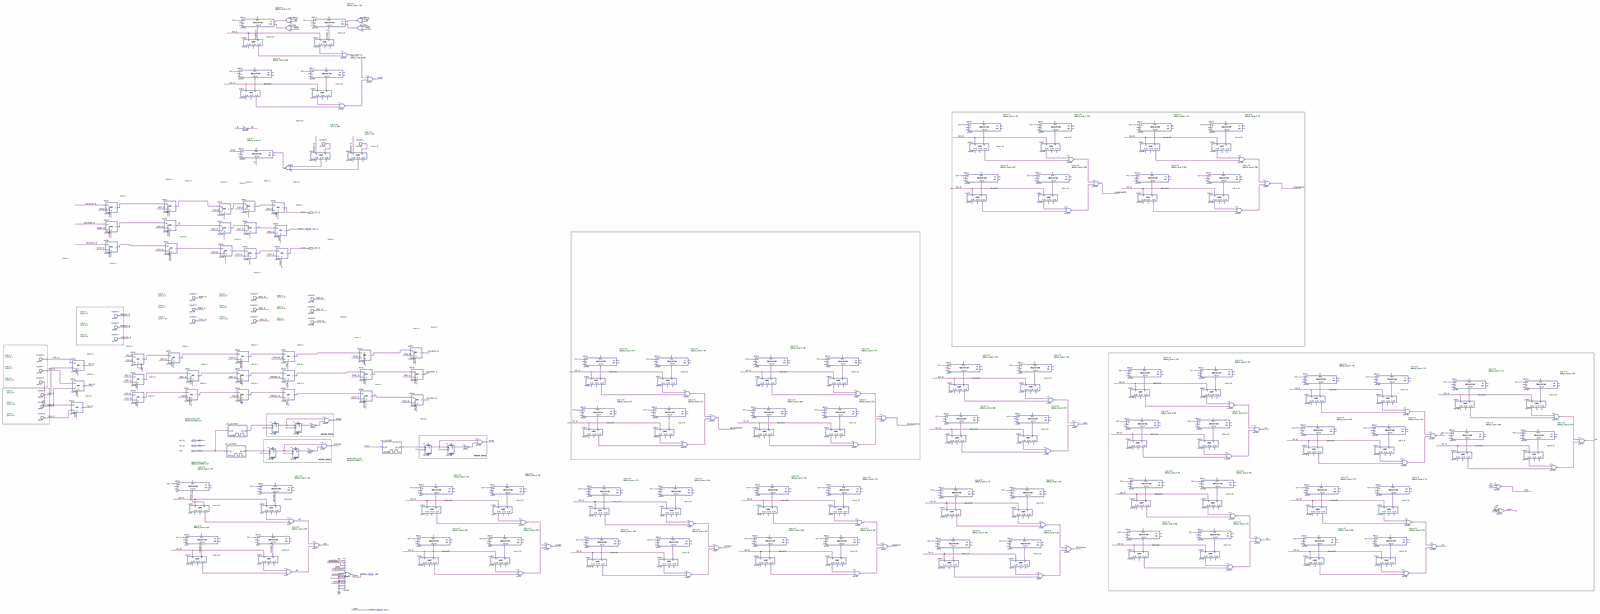
[diagram p0: schematic sheet, whole]
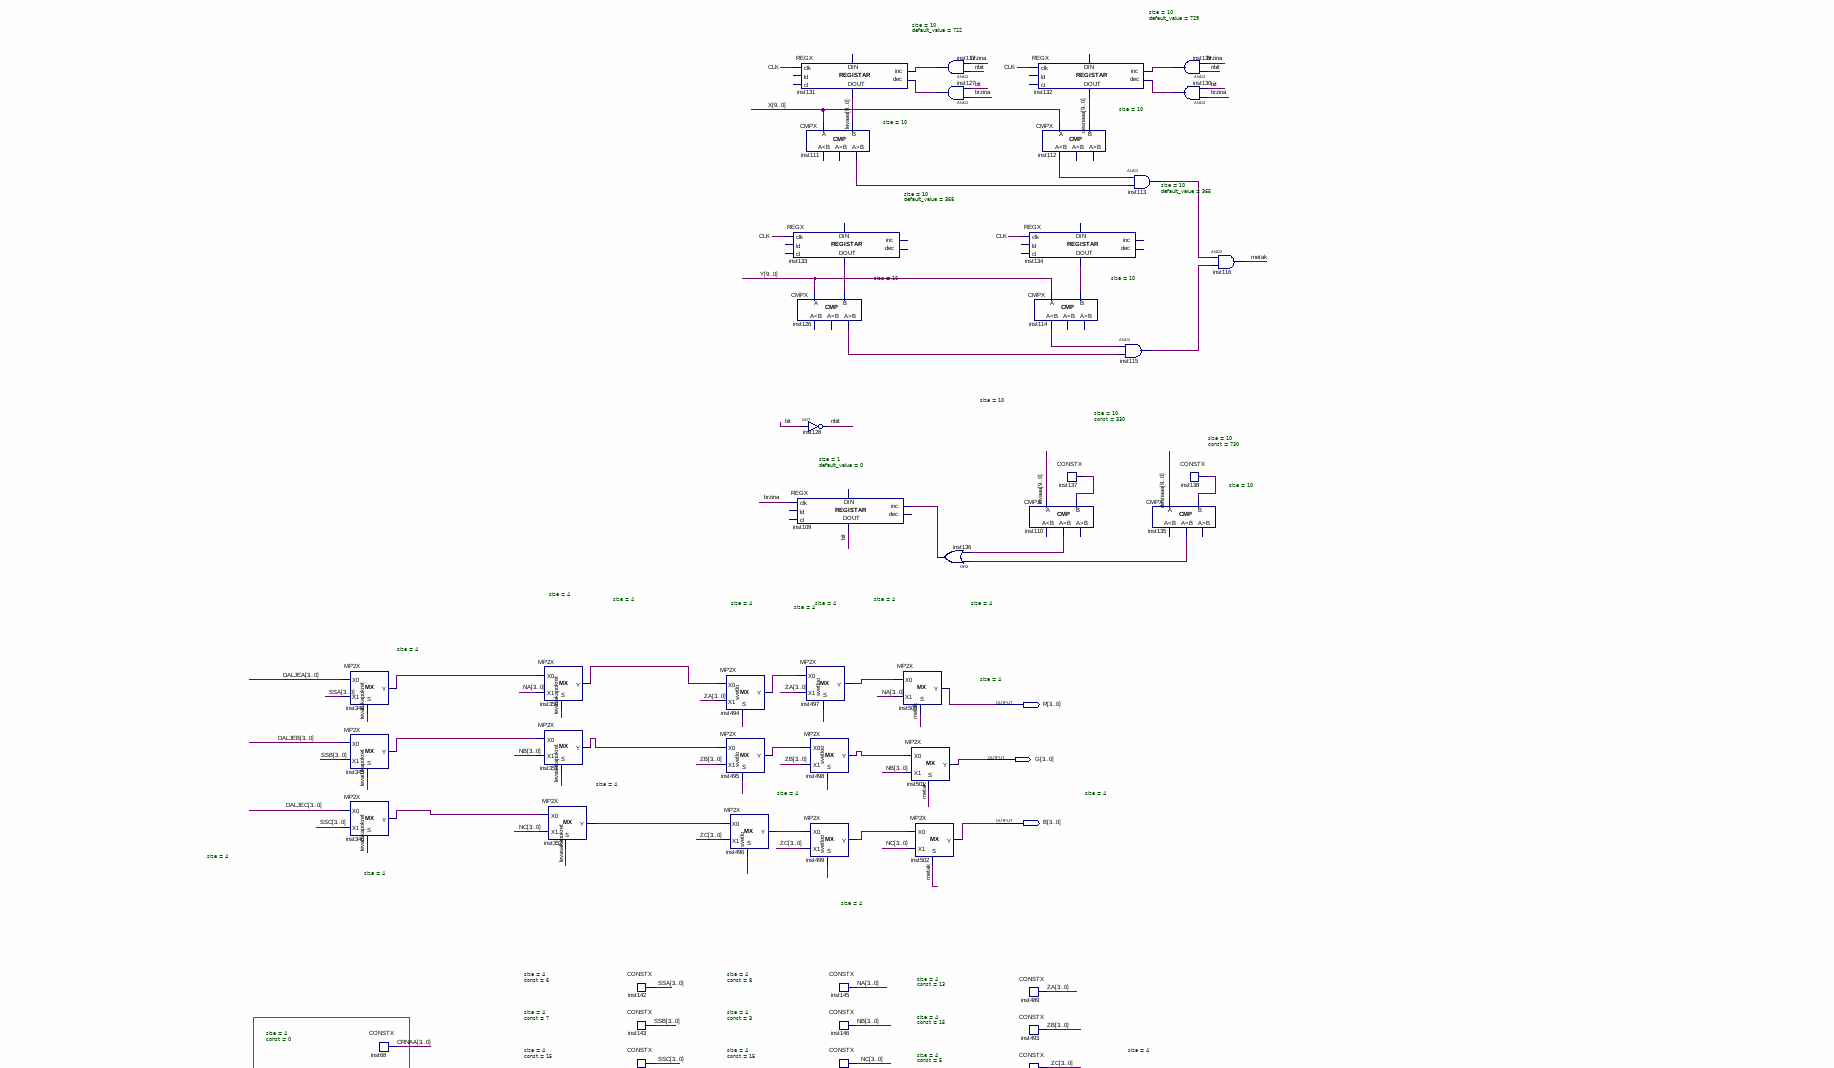
[diagram p1: schematic sheet, upper left part]
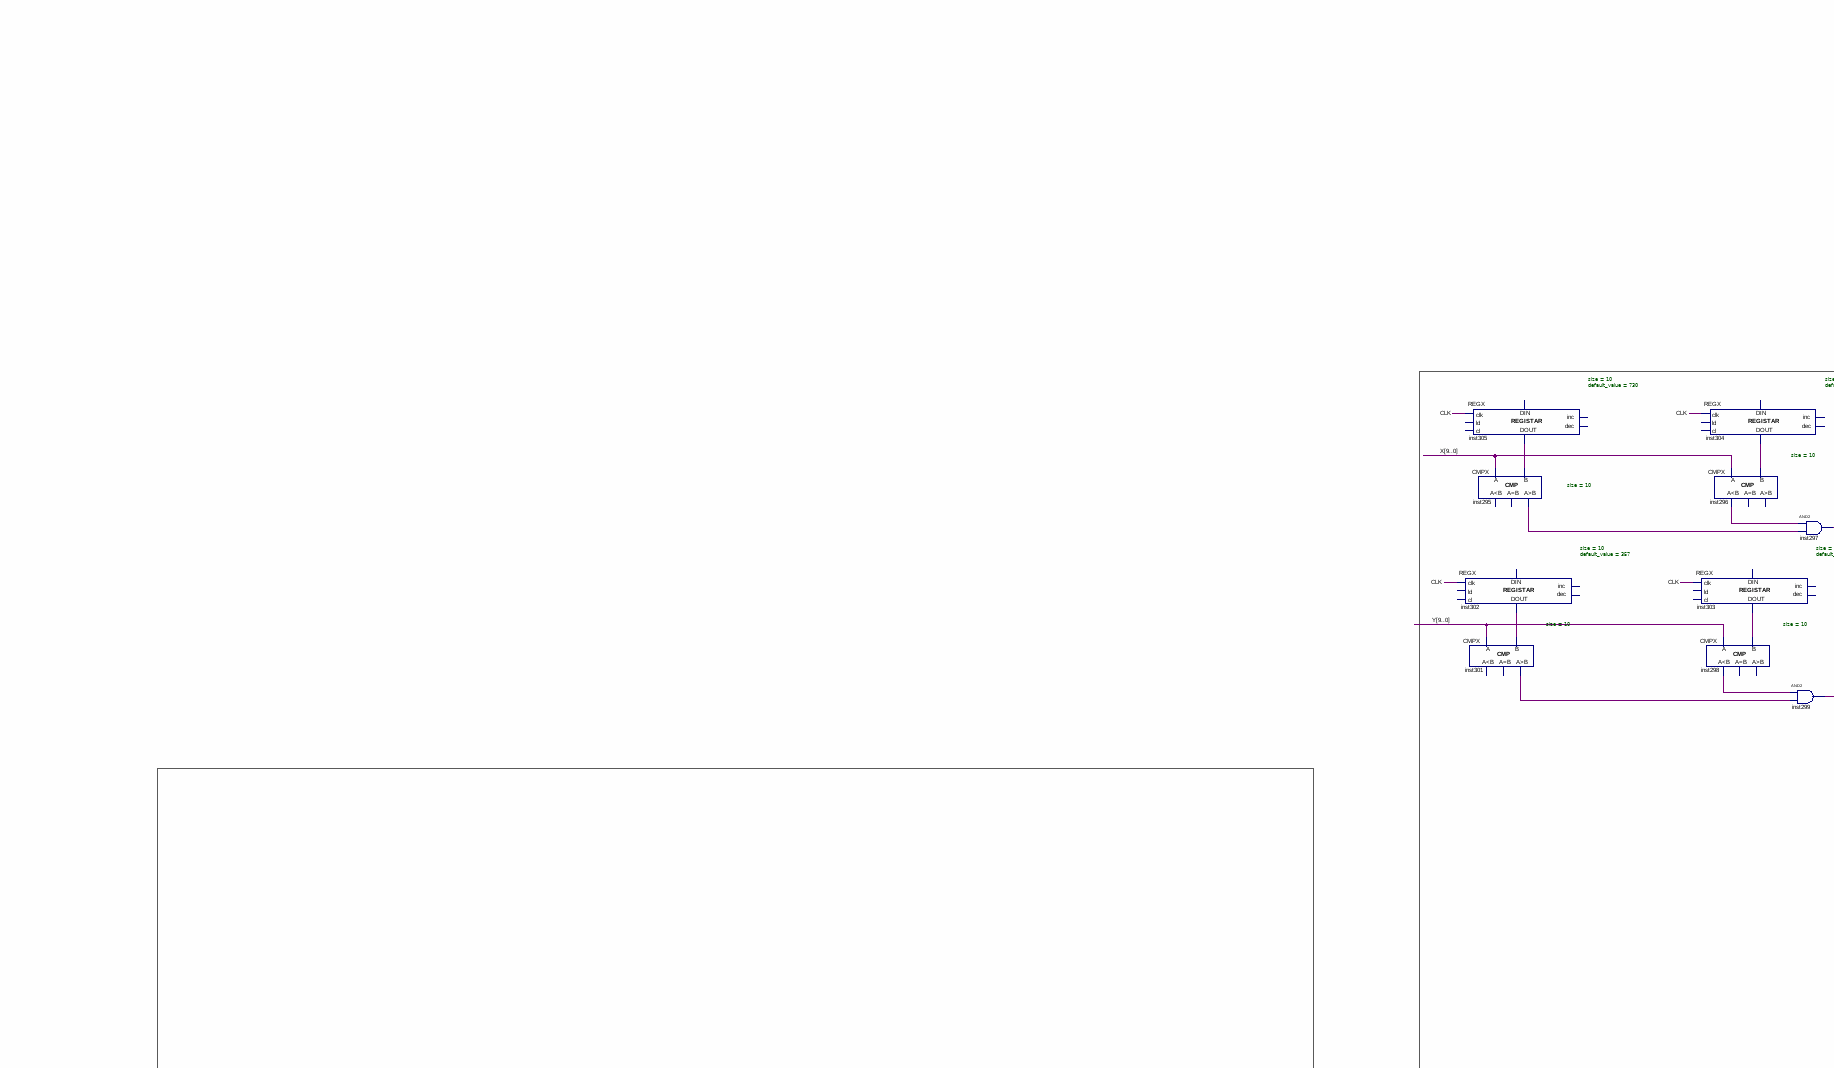
[diagram p2: schematic sheet, upper centre part]
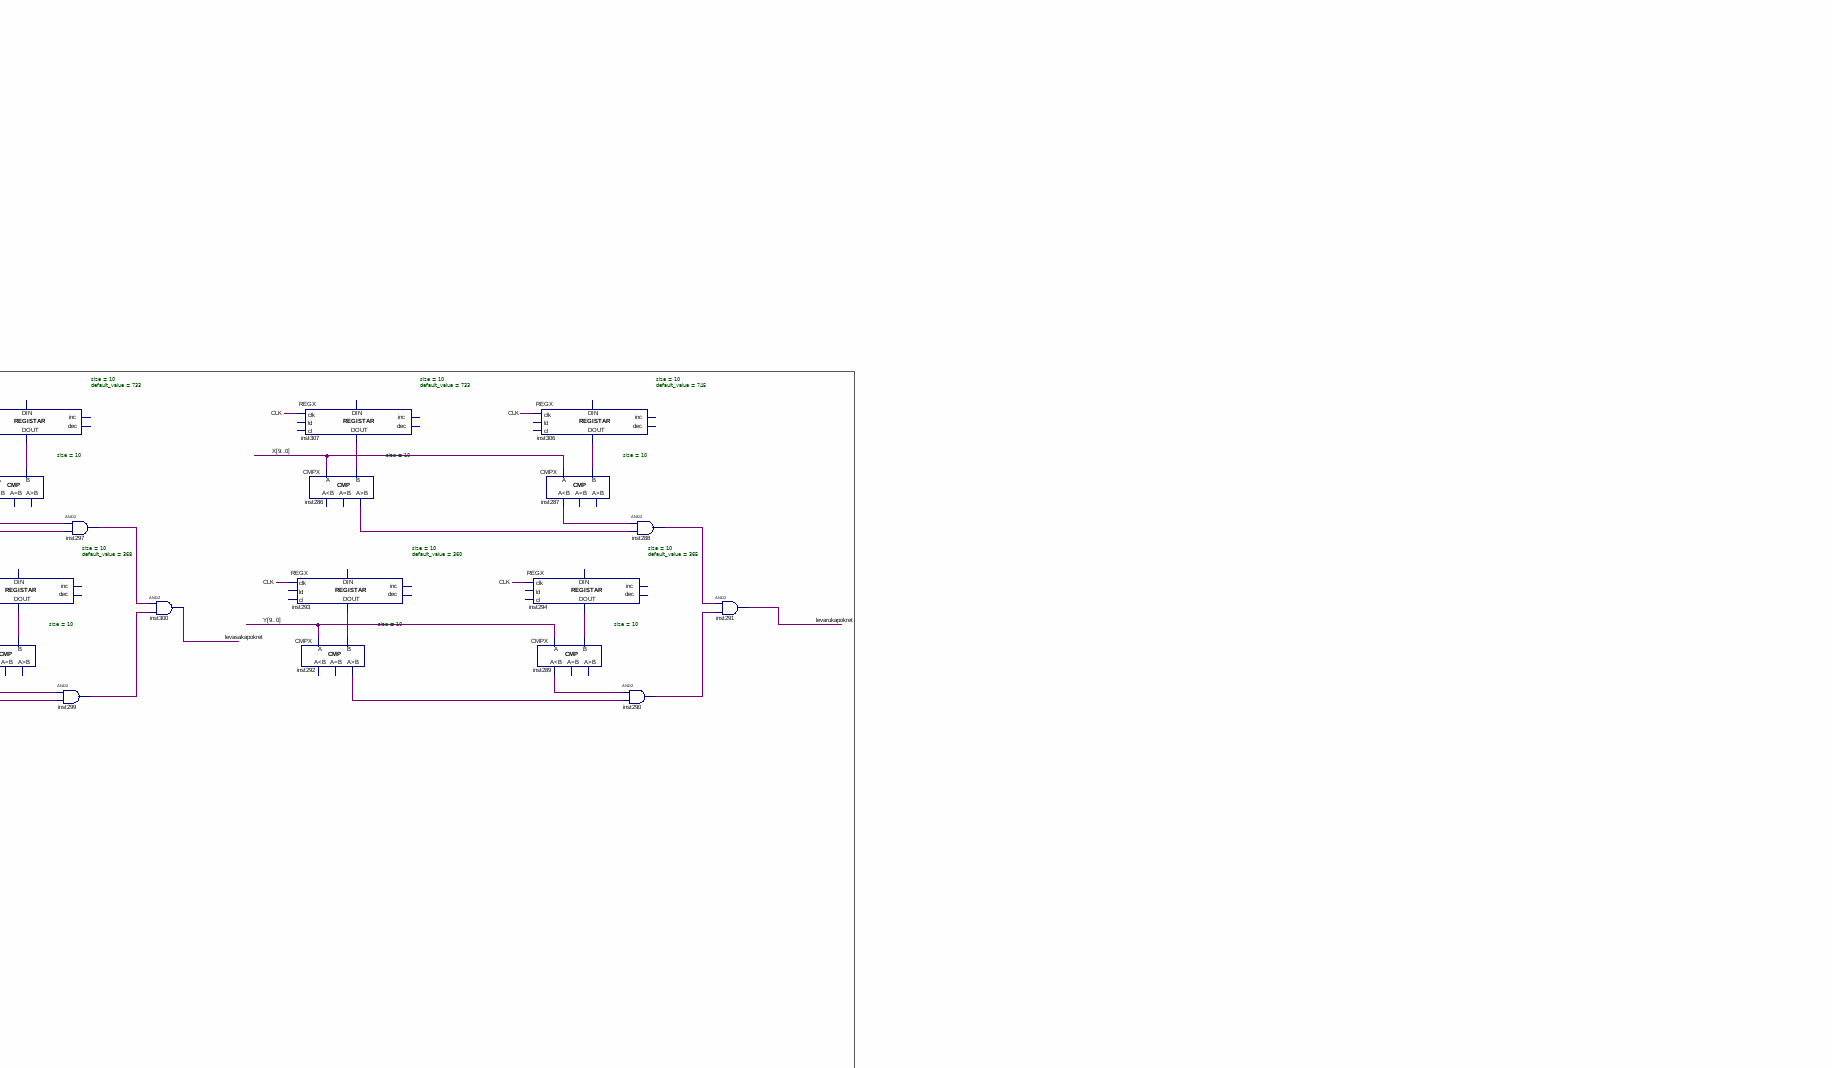
[diagram p3: schematic sheet, upper right part]
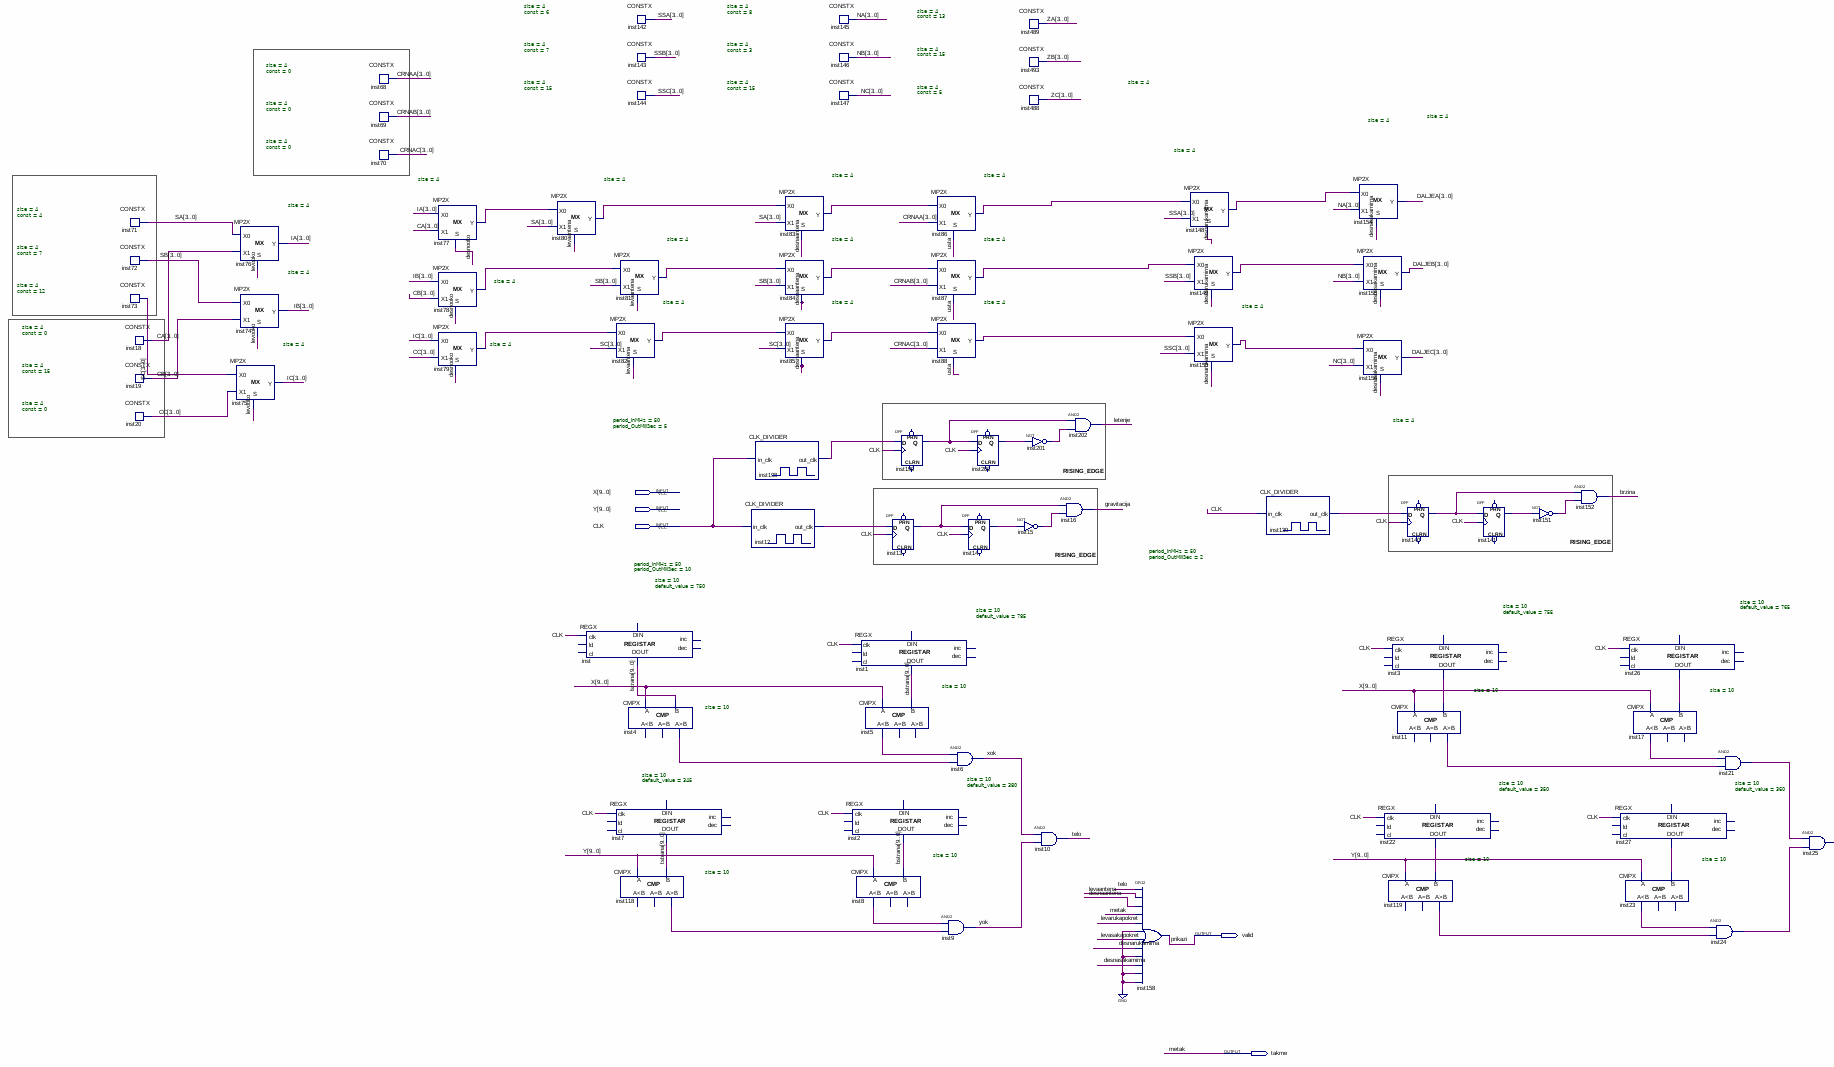
[diagram p4: schematic sheet, lower left part]
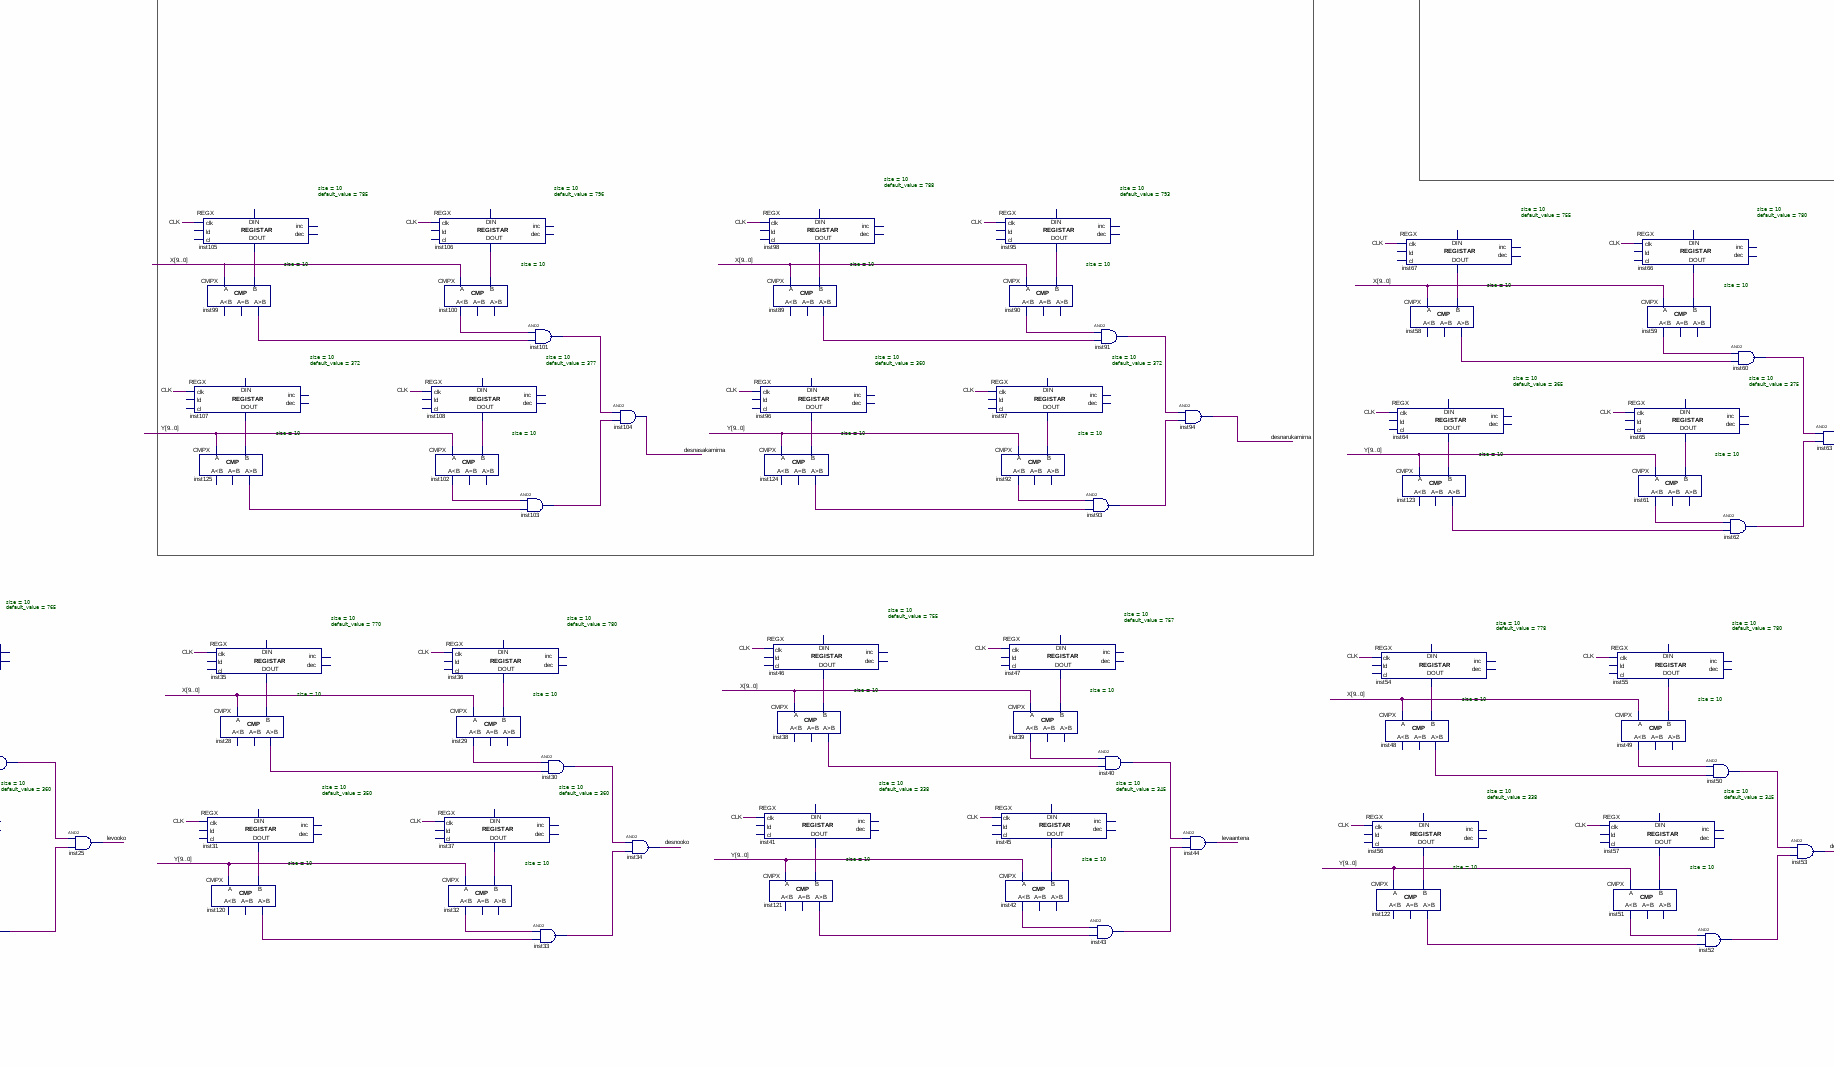
[diagram p5: schematic sheet, lower centre part]
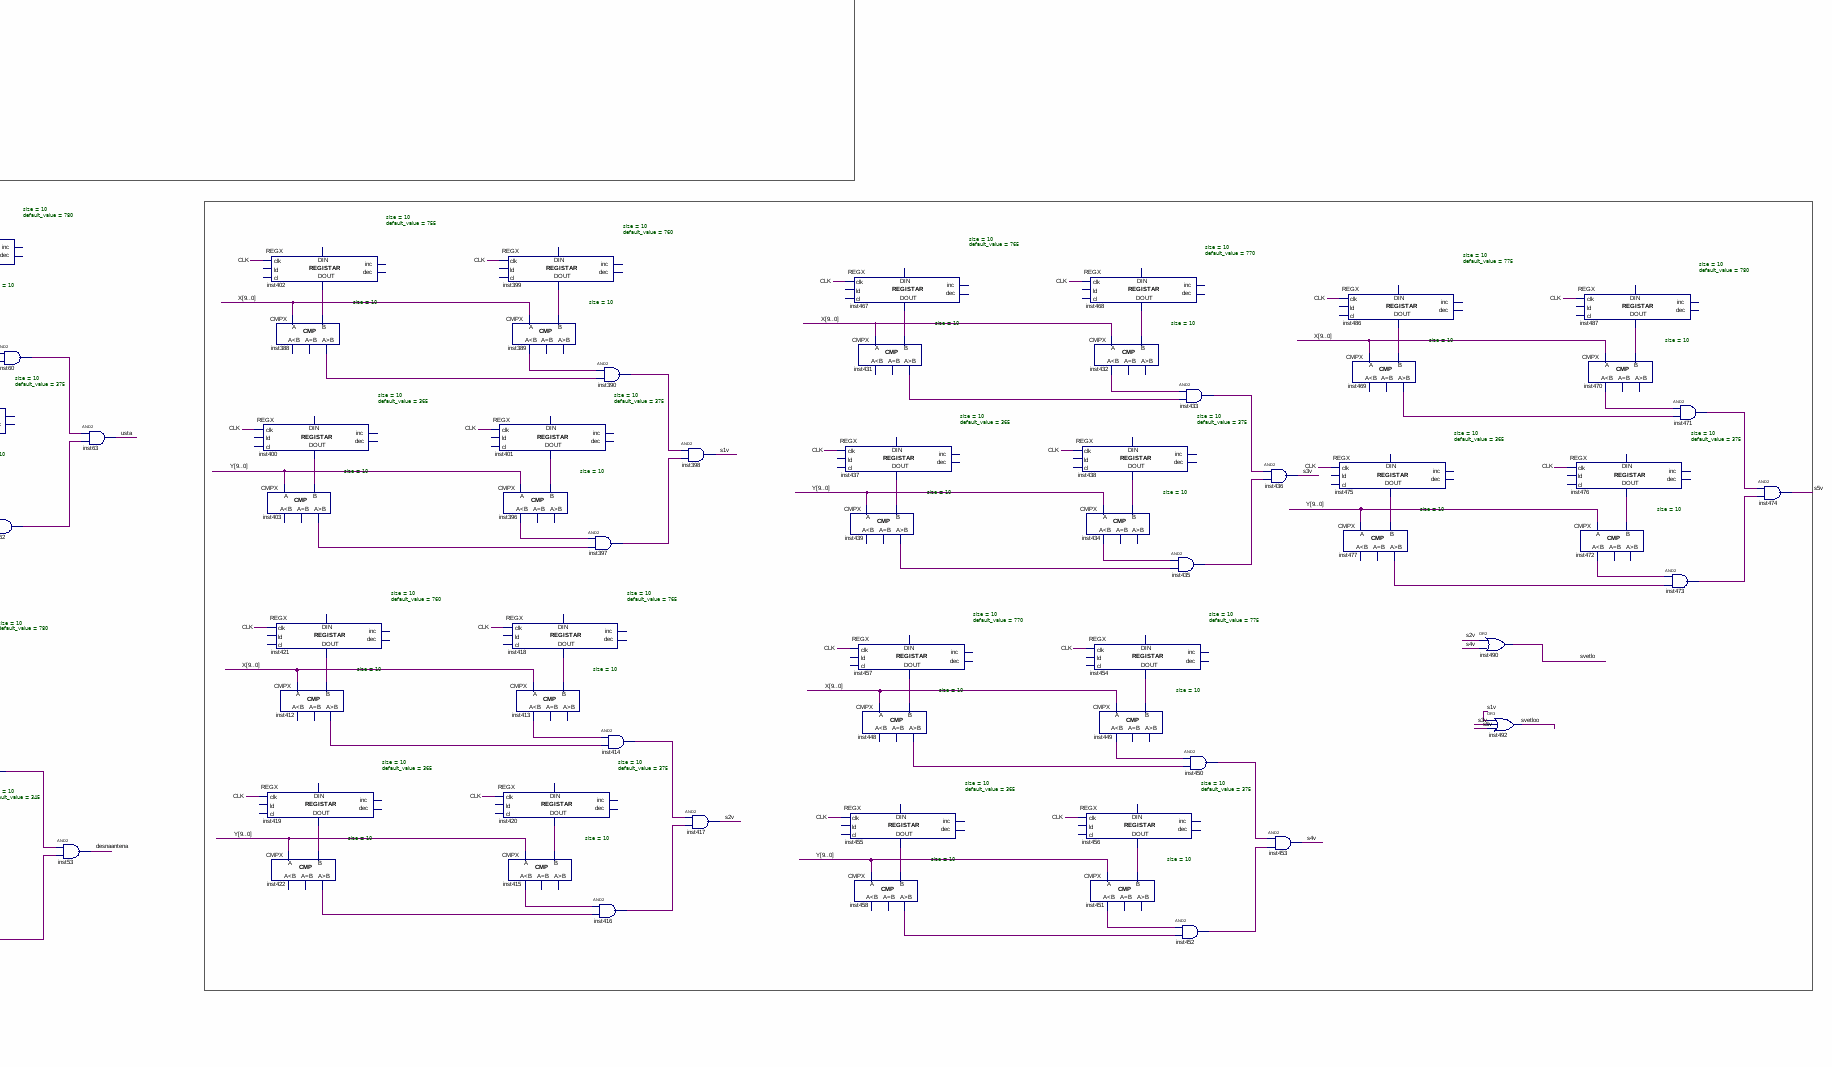
[diagram p6: schematic sheet, lower right part]
// Quartus schematic Bot3.bdf as structural Verilog: 259 symbols, 8 pins
module Bot3 (
  input  [9:0] X,
  input  [9:0] Y,
  input  CLK,
  output [3:0] R,
  output [3:0] G,
  output [3:0] B,
  output valid,
  output takme
);

  wire \bit , brzina, desnaantena, desnarukamirna, desnasakamirna, desnooko, gravitacija, inst4_gr, inst5_ls,
       inst8_ls, inst11_gr, inst12_out_clk, inst13_q, inst14_q, inst15_out, inst17_ls, inst21_out, inst23_ls,
       inst24_out, inst28_gr, inst29_ls, inst30_out, inst32_ls, inst33_out, inst38_gr, inst39_ls, inst40_out,
       inst42_ls, inst43_out, inst48_gr, inst49_ls, inst50_out, inst51_ls, inst52_out, inst58_gr, inst59_ls,
       inst60_out, inst61_ls, inst62_out, inst89_gr, inst90_ls, inst91_out, inst92_ls, inst93_out, inst99_gr,
       inst100_ls, inst101_out, inst102_ls, inst103_out, inst110_eq, inst111_gr, inst112_ls, inst113_out,
       inst114_ls, inst115_out, inst117_out, inst118_gr, inst119_gr, inst120_gr, inst121_gr, inst122_gr,
       inst123_gr, inst124_gr, inst125_gr, inst126_gr, inst127_out, inst129_out, inst130_out, inst135_eq,
       inst136_out, inst139_out_clk, inst140_q, inst141_q, inst151_out, inst198_out_clk, inst199_q,
       inst200_q, inst201_out, inst286_gr, inst287_ls, inst288_out, inst289_ls, inst290_out, inst292_gr,
       inst295_gr, inst296_ls, inst297_out, inst298_ls, inst299_out, inst301_gr, inst388_gr, inst389_ls,
       inst390_out, inst396_ls, inst397_out, inst403_gr, inst412_gr, inst413_ls, inst414_out, inst415_ls,
       inst416_out, inst422_gr, inst431_gr, inst432_ls, inst433_out, inst434_ls, inst435_out, inst439_gr,
       inst448_gr, inst449_ls, inst450_out, inst451_ls, inst452_out, inst458_gr, inst469_gr, inst470_ls,
       inst471_out, inst472_ls, inst473_out, inst477_gr, letenje, levaantena, levarukapokret, levasakapokret,
       levooko, nbit, s1v, s2v, s3v, s4v, s5v, svetlo, svetloo, telo, usta, xok, yok;
  wire [3:0] CA, CB, CC, CRNAA, CRNAB, CRNAC, DALJEA, DALJEB, DALJEC, IA, IB, IC, inst77_y, inst78_y,
       inst79_y, inst80_y, inst81_y, inst82_y, inst83_y, inst84_y, inst85_y, inst86_y, inst87_y, inst88_y,
       inst148_y, inst149_y, inst150_y, inst344_y, inst345_y, inst346_y, inst350_y, inst351_y, inst352_y,
       inst494_y, inst495_y, inst496_y, inst497_y, inst498_y, inst499_y, NA, NB, NC, SA, SB, SC, SSA, SSB,
       SSC, ZA, ZB, ZC;
  wire [9:0] bstrana, desnaaa, dstrana, inst3_data_out, inst22_data_out, inst26_data_out, inst27_data_out,
       inst31_data_out, inst35_data_out, inst36_data_out, inst37_data_out, inst41_data_out, inst45_data_out,
       inst46_data_out, inst47_data_out, inst54_data_out, inst55_data_out, inst56_data_out, inst57_data_out,
       inst64_data_out, inst65_data_out, inst66_data_out, inst67_data_out, inst95_data_out, inst96_data_out,
       inst97_data_out, inst98_data_out, inst105_data_out, inst106_data_out, inst107_data_out,
       inst108_data_out, inst133_data_out, inst134_data_out, inst137_data, inst138_data, inst293_data_out,
       inst294_data_out, inst302_data_out, inst303_data_out, inst304_data_out, inst305_data_out,
       inst306_data_out, inst307_data_out, inst399_data_out, inst400_data_out, inst401_data_out,
       inst402_data_out, inst418_data_out, inst419_data_out, inst420_data_out, inst421_data_out,
       inst437_data_out, inst438_data_out, inst454_data_out, inst455_data_out, inst456_data_out,
       inst457_data_out, inst467_data_out, inst468_data_out, inst475_data_out, inst476_data_out,
       inst486_data_out, inst487_data_out, levaaa, lstrana, tstrana;

  CONSTX #(.size(4), .\const (4)) inst71 (.data(SA));
  CONSTX #(.size(4), .\const (7)) inst72 (.data(SB));
  CONSTX #(.size(4), .\const (12)) inst73 (.data(SC));
  CONSTX #(.size(4), .\const (0)) inst18 (.data(CA));
  CONSTX #(.size(4), .\const (15)) inst19 (.data(CB));
  CONSTX #(.size(4), .\const (0)) inst20 (.data(CC));
  MP2X #(.size(4)) inst76 (.S(levooko), .X0(SA), .X1(CA), .Y(IA));
  MP2X #(.size(4)) inst74 (.S(levooko), .X0(SB), .X1(CB), .Y(IB));
  MP2X #(.size(4)) inst75 (.S(levooko), .X0(SC), .X1(CC), .Y(IC));
  MP2X #(.size(4)) inst344 (.S(levarukapokret), .X0(DALJEA), .X1(SSA), .Y(inst344_y));
  MP2X #(.size(4)) inst345 (.S(levarukapokret), .X0(DALJEB), .X1(SSB), .Y(inst345_y));
  MP2X #(.size(4)) inst346 (.S(levarukapokret), .X0(DALJEC), .X1(SSC), .Y(inst346_y));
  CONSTX #(.size(4), .\const (0)) inst68 (.data(CRNAA));
  CONSTX #(.size(4), .\const (0)) inst69 (.data(CRNAB));
  CONSTX #(.size(4), .\const (0)) inst70 (.data(CRNAC));
  MP2X #(.size(4)) inst77 (.S(desnooko), .X0(IA), .X1(CA), .Y(inst77_y));
  MP2X #(.size(4)) inst78 (.S(desnooko), .X0(IB), .X1(CB), .Y(inst78_y));
  MP2X #(.size(4)) inst79 (.S(desnooko), .X0(IC), .X1(CC), .Y(inst79_y));
  MP2X #(.size(4)) inst350 (.S(levasakapokret), .X0(inst344_y), .X1(NA), .Y(inst350_y));
  MP2X #(.size(4)) inst351 (.S(levasakapokret), .X0(inst345_y), .X1(NB), .Y(inst351_y));
  MP2X #(.size(4)) inst352 (.S(levasakapokret), .X0(inst346_y), .X1(NC), .Y(inst352_y));
  MP2X #(.size(4)) inst80 (.S(levaantena), .X0(inst77_y), .X1(SA), .Y(inst80_y));
  REGX #(.size(10), .default_value(750)) inst (.clk(CLK), .data_out(lstrana));  // open: ld, cl, inc, dec, data_in
  CONSTX #(.size(4), .\const (6)) inst142 (.data(SSA));
  CONSTX #(.size(4), .\const (7)) inst143 (.data(SSB));
  CONSTX #(.size(4), .\const (15)) inst144 (.data(SSC));
  MP2X #(.size(4)) inst81 (.S(levaantena), .X0(inst78_y), .X1(SB), .Y(inst81_y));
  MP2X #(.size(4)) inst82 (.S(levaantena), .X0(inst79_y), .X1(SC), .Y(inst82_y));
  CMPX #(.size(10)) inst4 (.A(X), .B(lstrana), .gr(inst4_gr));  // open: ls, eq
  REGX #(.size(10), .default_value(345)) inst7 (.clk(CLK), .data_out(tstrana));  // open: ld, cl, inc, dec, data_in
  CMPX #(.size(10)) inst118 (.A(Y), .B(tstrana), .gr(inst118_gr));  // open: ls, eq
  MP2X #(.size(4)) inst494 (.S(svetlo), .X0(inst350_y), .X1(ZA), .Y(inst494_y));
  MP2X #(.size(4)) inst495 (.S(svetlo), .X0(inst351_y), .X1(ZB), .Y(inst495_y));
  MP2X #(.size(4)) inst496 (.S(svetlo), .X0(inst352_y), .X1(ZC), .Y(inst496_y));
  CLK_DIVIDER #(.period_InMHz(50), .period_OutMiliSec(5)) inst198 (.in_clk(CLK), .out_clk(inst198_out_clk));
  CLK_DIVIDER #(.period_InMHz(50), .period_OutMiliSec(10)) inst12 (.in_clk(CLK), .out_clk(inst12_out_clk));
  REGX #(.size(10), .default_value(722)) inst131 (
    .clk(CLK), .inc(inst117_out), .dec(inst127_out), .data_out(levaaa));  // open: ld, cl, data_in
  CMPX #(.size(10)) inst111 (.A(X), .B(levaaa), .gr(inst111_gr));  // open: ls, eq
  REGX #(.size(10), .default_value(358)) inst133 (
    .clk(CLK), .data_out(inst133_data_out));  // open: ld, cl, inc, dec, data_in
  CMPX #(.size(10)) inst126 (.A(Y), .B(inst133_data_out), .gr(inst126_gr));  // open: ls, eq
  not inst128 (nbit, \bit );
  REGX #(.size(1), .default_value(0)) inst109 (
    .clk(brzina), .inc(inst136_out), .data_out(\bit ));  // open: ld, cl, dec, data_in
  MP2X #(.size(4)) inst497 (.S(svetloo), .X0(inst494_y), .X1(ZA), .Y(inst497_y));
  MP2X #(.size(4)) inst498 (.S(svetloo), .X0(inst495_y), .X1(ZB), .Y(inst498_y));
  MP2X #(.size(4)) inst499 (.S(svetloo), .X0(inst496_y), .X1(ZC), .Y(inst499_y));
  MP2X #(.size(4)) inst83 (.S(desnaantena), .X0(inst80_y), .X1(SA), .Y(inst83_y));
  MP2X #(.size(4)) inst84 (.S(desnaantena), .X0(inst81_y), .X1(SB), .Y(inst84_y));
  MP2X #(.size(4)) inst85 (.S(desnaantena), .X0(inst82_y), .X1(SC), .Y(inst85_y));
  CONSTX #(.size(4), .\const (8)) inst145 (.data(NA));
  CONSTX #(.size(4), .\const (3)) inst146 (.data(NB));
  CONSTX #(.size(4), .\const (15)) inst147 (.data(NC));
  REGX #(.size(10), .default_value(785)) inst1 (.clk(CLK), .data_out(dstrana));  // open: ld, cl, inc, dec, data_in
  CMPX #(.size(10)) inst5 (.A(X), .B(dstrana), .ls(inst5_ls));  // open: eq, gr
  REGX #(.size(10), .default_value(380)) inst2 (.clk(CLK), .data_out(bstrana));  // open: ld, cl, inc, dec, data_in
  CMPX #(.size(10)) inst8 (.A(Y), .B(bstrana), .ls(inst8_ls));  // open: eq, gr
  MP2X #(.size(4)) inst500 (.S(takme), .X0(inst497_y), .X1(NA), .Y(R));
  MP2X #(.size(4)) inst501 (.S(takme), .X0(inst498_y), .X1(NB), .Y(G));
  MP2X #(.size(4)) inst502 (.S(takme), .X0(inst499_y), .X1(NC), .Y(B));
  DFF inst199 (.CLK(CLK), .D(inst198_out_clk), .Q(inst199_q));  // open: CLRN, PRN
  DFF inst13 (.CLK(CLK), .D(inst12_out_clk), .Q(inst13_q));  // open: CLRN, PRN
  and inst117 (inst117_out, nbit, brzina);
  and inst127 (inst127_out, brzina, \bit );
  or inst136 (inst136_out, inst135_eq, inst110_eq);
  MP2X #(.size(4)) inst86 (.S(usta), .X0(inst83_y), .X1(CRNAA), .Y(inst86_y));
  MP2X #(.size(4)) inst87 (.S(usta), .X0(inst84_y), .X1(CRNAB), .Y(inst87_y));
  MP2X #(.size(4)) inst88 (.S(usta), .X0(inst85_y), .X1(CRNAC), .Y(inst88_y));
  and inst9 (yok, inst8_ls, inst118_gr);
  DFF inst200 (.CLK(CLK), .D(inst199_q), .Q(inst200_q));  // open: CLRN, PRN
  DFF inst14 (.CLK(CLK), .D(inst13_q), .Q(inst14_q));  // open: CLRN, PRN
  and inst6 (xok, inst5_ls, inst4_gr);
  REGX #(.size(10), .default_value(729)) inst132 (
    .clk(CLK), .inc(inst129_out), .dec(inst130_out), .data_out(desnaaa));  // open: ld, cl, data_in
  CMPX #(.size(10)) inst112 (.A(X), .B(desnaaa), .ls(inst112_ls));  // open: eq, gr
  REGX #(.size(10), .default_value(365)) inst134 (
    .clk(CLK), .data_out(inst134_data_out));  // open: ld, cl, inc, dec, data_in
  CMPX #(.size(10)) inst114 (.A(Y), .B(inst134_data_out), .ls(inst114_ls));  // open: eq, gr
  CMPX #(.size(10)) inst110 (.A(levaaa), .B(inst137_data), .eq(inst110_eq));  // open: ls, gr
  CONSTX #(.size(4), .\const (13)) inst489 (.data(ZA));
  CONSTX #(.size(4), .\const (15)) inst493 (.data(ZB));
  CONSTX #(.size(4), .\const (5)) inst488 (.data(ZC));
  not inst201 (inst201_out, inst200_q);
  not inst15 (inst15_out, inst14_q);
  and inst10 (telo, xok, yok);
  CONSTX #(.size(10), .\const (330)) inst137 (.data(inst137_data));
  and inst202 (letenje, inst199_q, inst201_out);
  and inst16 (gravitacija, inst13_q, inst15_out);
  and inst113 (inst113_out, inst112_ls, inst111_gr);
  and inst115 (inst115_out, inst114_ls, inst126_gr);
  CMPX #(.size(10)) inst135 (.A(desnaaa), .B(inst138_data), .eq(inst135_eq));  // open: ls, gr
  or inst158 (valid, telo, levaantena, desnaantena, takme, levarukapokret, 1'b0, levasakapokret, desnarukamirna, 1'b0, desnasakamirna, 1'b0, 1'b0);
  and inst129 (inst129_out, nbit, brzina);
  and inst130 (inst130_out, brzina, \bit );
  CONSTX #(.size(10), .\const (730)) inst138 (.data(inst138_data));
  and inst116 (takme, inst113_out, inst115_out);
  MP2X #(.size(4)) inst148 (.S(desnarukamirna), .X0(inst86_y), .X1(SSA), .Y(inst148_y));
  MP2X #(.size(4)) inst149 (.S(desnarukamirna), .X0(inst87_y), .X1(SSB), .Y(inst149_y));
  MP2X #(.size(4)) inst150 (.S(desnarukamirna), .X0(inst88_y), .X1(SSC), .Y(inst150_y));
  CLK_DIVIDER #(.period_InMHz(50), .period_OutMiliSec(2)) inst139 (.in_clk(CLK), .out_clk(inst139_out_clk));
  MP2X #(.size(4)) inst154 (.S(desnasakamirna), .X0(inst148_y), .X1(NA), .Y(DALJEA));
  MP2X #(.size(4)) inst155 (.S(desnasakamirna), .X0(inst149_y), .X1(NB), .Y(DALJEB));
  MP2X #(.size(4)) inst156 (.S(desnasakamirna), .X0(inst150_y), .X1(NC), .Y(DALJEC));
  REGX #(.size(10), .default_value(350)) inst22 (
    .clk(CLK), .data_out(inst22_data_out));  // open: ld, cl, inc, dec, data_in
  CMPX #(.size(10)) inst119 (.A(Y), .B(inst22_data_out), .gr(inst119_gr));  // open: ls, eq
  DFF inst140 (.CLK(CLK), .D(inst139_out_clk), .Q(inst140_q));  // open: CLRN, PRN
  REGX #(.size(10), .default_value(755)) inst3 (
    .clk(CLK), .data_out(inst3_data_out));  // open: ld, cl, inc, dec, data_in
  CMPX #(.size(10)) inst11 (.A(X), .B(inst3_data_out), .gr(inst11_gr));  // open: ls, eq
  DFF inst141 (.CLK(CLK), .D(inst140_q), .Q(inst141_q));  // open: CLRN, PRN
  not inst151 (inst151_out, inst141_q);
  and inst152 (brzina, inst140_q, inst151_out);
  REGX #(.size(10), .default_value(360)) inst27 (
    .clk(CLK), .data_out(inst27_data_out));  // open: ld, cl, inc, dec, data_in
  CMPX #(.size(10)) inst23 (.A(Y), .B(inst27_data_out), .ls(inst23_ls));  // open: eq, gr
  REGX #(.size(10), .default_value(765)) inst26 (
    .clk(CLK), .data_out(inst26_data_out));  // open: ld, cl, inc, dec, data_in
  CMPX #(.size(10)) inst17 (.A(X), .B(inst26_data_out), .ls(inst17_ls));  // open: eq, gr
  and inst21 (inst21_out, inst17_ls, inst11_gr);
  and inst24 (inst24_out, inst23_ls, inst119_gr);
  and inst25 (levooko, inst21_out, inst24_out);
  REGX #(.size(10), .default_value(372)) inst107 (
    .clk(CLK), .data_out(inst107_data_out));  // open: ld, cl, inc, dec, data_in
  REGX #(.size(10), .default_value(785)) inst105 (
    .clk(CLK), .data_out(inst105_data_out));  // open: ld, cl, inc, dec, data_in
  CMPX #(.size(10)) inst99 (.A(X), .B(inst105_data_out), .gr(inst99_gr));  // open: ls, eq
  CMPX #(.size(10)) inst125 (.A(Y), .B(inst107_data_out), .gr(inst125_gr));  // open: ls, eq
  REGX #(.size(10), .default_value(770)) inst35 (
    .clk(CLK), .data_out(inst35_data_out));  // open: ld, cl, inc, dec, data_in
  CMPX #(.size(10)) inst28 (.A(X), .B(inst35_data_out), .gr(inst28_gr));  // open: ls, eq
  REGX #(.size(10), .default_value(350)) inst31 (
    .clk(CLK), .data_out(inst31_data_out));  // open: ld, cl, inc, dec, data_in
  CMPX #(.size(10)) inst120 (.A(Y), .B(inst31_data_out), .gr(inst120_gr));  // open: ls, eq
  REGX #(.size(10), .default_value(377)) inst108 (
    .clk(CLK), .data_out(inst108_data_out));  // open: ld, cl, inc, dec, data_in
  REGX #(.size(10), .default_value(796)) inst106 (
    .clk(CLK), .data_out(inst106_data_out));  // open: ld, cl, inc, dec, data_in
  CMPX #(.size(10)) inst100 (.A(X), .B(inst106_data_out), .ls(inst100_ls));  // open: eq, gr
  CMPX #(.size(10)) inst102 (.A(Y), .B(inst108_data_out), .ls(inst102_ls));  // open: eq, gr
  REGX #(.size(10), .default_value(780)) inst36 (
    .clk(CLK), .data_out(inst36_data_out));  // open: ld, cl, inc, dec, data_in
  CMPX #(.size(10)) inst29 (.A(X), .B(inst36_data_out), .ls(inst29_ls));  // open: eq, gr
  REGX #(.size(10), .default_value(360)) inst37 (
    .clk(CLK), .data_out(inst37_data_out));  // open: ld, cl, inc, dec, data_in
  CMPX #(.size(10)) inst32 (.A(Y), .B(inst37_data_out), .ls(inst32_ls));  // open: eq, gr
  and inst103 (inst103_out, inst102_ls, inst125_gr);
  and inst101 (inst101_out, inst100_ls, inst99_gr);
  and inst30 (inst30_out, inst29_ls, inst28_gr);
  and inst33 (inst33_out, inst32_ls, inst120_gr);
  and inst104 (desnasakamirna, inst101_out, inst103_out);
  and inst34 (desnooko, inst30_out, inst33_out);
  REGX #(.size(10), .default_value(788)) inst98 (
    .clk(CLK), .data_out(inst98_data_out));  // open: ld, cl, inc, dec, data_in
  REGX #(.size(10), .default_value(360)) inst96 (
    .clk(CLK), .data_out(inst96_data_out));  // open: ld, cl, inc, dec, data_in
  CMPX #(.size(10)) inst124 (.A(Y), .B(inst96_data_out), .gr(inst124_gr));  // open: ls, eq
  REGX #(.size(10), .default_value(338)) inst41 (
    .clk(CLK), .data_out(inst41_data_out));  // open: ld, cl, inc, dec, data_in
  CMPX #(.size(10)) inst121 (.A(Y), .B(inst41_data_out), .gr(inst121_gr));  // open: ls, eq
  CMPX #(.size(10)) inst89 (.A(X), .B(inst98_data_out), .gr(inst89_gr));  // open: ls, eq
  REGX #(.size(10), .default_value(755)) inst46 (
    .clk(CLK), .data_out(inst46_data_out));  // open: ld, cl, inc, dec, data_in
  CMPX #(.size(10)) inst38 (.A(X), .B(inst46_data_out), .gr(inst38_gr));  // open: ls, eq
  REGX #(.size(10), .default_value(793)) inst95 (
    .clk(CLK), .data_out(inst95_data_out));  // open: ld, cl, inc, dec, data_in
  REGX #(.size(10), .default_value(372)) inst97 (
    .clk(CLK), .data_out(inst97_data_out));  // open: ld, cl, inc, dec, data_in
  CMPX #(.size(10)) inst92 (.A(Y), .B(inst97_data_out), .ls(inst92_ls));  // open: eq, gr
  REGX #(.size(10), .default_value(345)) inst45 (
    .clk(CLK), .data_out(inst45_data_out));  // open: ld, cl, inc, dec, data_in
  CMPX #(.size(10)) inst42 (.A(Y), .B(inst45_data_out), .ls(inst42_ls));  // open: eq, gr
  CMPX #(.size(10)) inst90 (.A(X), .B(inst95_data_out), .ls(inst90_ls));  // open: eq, gr
  REGX #(.size(10), .default_value(757)) inst47 (
    .clk(CLK), .data_out(inst47_data_out));  // open: ld, cl, inc, dec, data_in
  CMPX #(.size(10)) inst39 (.A(X), .B(inst47_data_out), .ls(inst39_ls));  // open: eq, gr
  and inst91 (inst91_out, inst90_ls, inst89_gr);
  and inst93 (inst93_out, inst92_ls, inst124_gr);
  and inst40 (inst40_out, inst39_ls, inst38_gr);
  and inst43 (inst43_out, inst42_ls, inst121_gr);
  and inst94 (desnarukamirna, inst91_out, inst93_out);
  and inst44 (levaantena, inst40_out, inst43_out);
  REGX #(.size(10), .default_value(338)) inst56 (
    .clk(CLK), .data_out(inst56_data_out));  // open: ld, cl, inc, dec, data_in
  CMPX #(.size(10)) inst122 (.A(Y), .B(inst56_data_out), .gr(inst122_gr));  // open: ls, eq
  REGX #(.size(10), .default_value(755)) inst67 (
    .clk(CLK), .data_out(inst67_data_out));  // open: ld, cl, inc, dec, data_in
  CMPX #(.size(10)) inst58 (.A(X), .B(inst67_data_out), .gr(inst58_gr));  // open: ls, eq
  REGX #(.size(10), .default_value(365)) inst64 (
    .clk(CLK), .data_out(inst64_data_out));  // open: ld, cl, inc, dec, data_in
  CMPX #(.size(10)) inst123 (.A(Y), .B(inst64_data_out), .gr(inst123_gr));  // open: ls, eq
  REGX #(.size(10), .default_value(778)) inst54 (
    .clk(CLK), .data_out(inst54_data_out));  // open: ld, cl, inc, dec, data_in
  CMPX #(.size(10)) inst48 (.A(X), .B(inst54_data_out), .gr(inst48_gr));  // open: ls, eq
  REGX #(.size(10), .default_value(730)) inst305 (
    .clk(CLK), .data_out(inst305_data_out));  // open: ld, cl, inc, dec, data_in
  CMPX #(.size(10)) inst295 (.A(X), .B(inst305_data_out), .gr(inst295_gr));  // open: ls, eq
  REGX #(.size(10), .default_value(357)) inst302 (
    .clk(CLK), .data_out(inst302_data_out));  // open: ld, cl, inc, dec, data_in
  CMPX #(.size(10)) inst301 (.A(Y), .B(inst302_data_out), .gr(inst301_gr));  // open: ls, eq
  REGX #(.size(10), .default_value(345)) inst57 (
    .clk(CLK), .data_out(inst57_data_out));  // open: ld, cl, inc, dec, data_in
  CMPX #(.size(10)) inst51 (.A(Y), .B(inst57_data_out), .ls(inst51_ls));  // open: eq, gr
  REGX #(.size(10), .default_value(780)) inst66 (
    .clk(CLK), .data_out(inst66_data_out));  // open: ld, cl, inc, dec, data_in
  CMPX #(.size(10)) inst59 (.A(X), .B(inst66_data_out), .ls(inst59_ls));  // open: eq, gr
  REGX #(.size(10), .default_value(375)) inst65 (
    .clk(CLK), .data_out(inst65_data_out));  // open: ld, cl, inc, dec, data_in
  CMPX #(.size(10)) inst61 (.A(Y), .B(inst65_data_out), .ls(inst61_ls));  // open: eq, gr
  REGX #(.size(10), .default_value(780)) inst55 (
    .clk(CLK), .data_out(inst55_data_out));  // open: ld, cl, inc, dec, data_in
  CMPX #(.size(10)) inst49 (.A(X), .B(inst55_data_out), .ls(inst49_ls));  // open: eq, gr
  REGX #(.size(10), .default_value(733)) inst304 (
    .clk(CLK), .data_out(inst304_data_out));  // open: ld, cl, inc, dec, data_in
  CMPX #(.size(10)) inst296 (.A(X), .B(inst304_data_out), .ls(inst296_ls));  // open: eq, gr
  REGX #(.size(10), .default_value(368)) inst303 (
    .clk(CLK), .data_out(inst303_data_out));  // open: ld, cl, inc, dec, data_in
  CMPX #(.size(10)) inst298 (.A(Y), .B(inst303_data_out), .ls(inst298_ls));  // open: eq, gr
  and inst50 (inst50_out, inst49_ls, inst48_gr);
  and inst52 (inst52_out, inst51_ls, inst122_gr);
  and inst60 (inst60_out, inst59_ls, inst58_gr);
  and inst62 (inst62_out, inst61_ls, inst123_gr);
  and inst297 (inst297_out, inst296_ls, inst295_gr);
  and inst299 (inst299_out, inst298_ls, inst301_gr);
  and inst53 (desnaantena, inst50_out, inst52_out);
  and inst63 (usta, inst60_out, inst62_out);
  and inst300 (levasakapokret, inst297_out, inst299_out);
  REGX #(.size(10), .default_value(755)) inst402 (
    .clk(CLK), .data_out(inst402_data_out));  // open: ld, cl, inc, dec, data_in
  CMPX #(.size(10)) inst388 (.A(X), .B(inst402_data_out), .gr(inst388_gr));  // open: ls, eq
  REGX #(.size(10), .default_value(365)) inst400 (
    .clk(CLK), .data_out(inst400_data_out));  // open: ld, cl, inc, dec, data_in
  CMPX #(.size(10)) inst403 (.A(Y), .B(inst400_data_out), .gr(inst403_gr));  // open: ls, eq
  REGX #(.size(10), .default_value(760)) inst421 (
    .clk(CLK), .data_out(inst421_data_out));  // open: ld, cl, inc, dec, data_in
  CMPX #(.size(10)) inst412 (.A(X), .B(inst421_data_out), .gr(inst412_gr));  // open: ls, eq
  REGX #(.size(10), .default_value(365)) inst419 (
    .clk(CLK), .data_out(inst419_data_out));  // open: ld, cl, inc, dec, data_in
  CMPX #(.size(10)) inst422 (.A(Y), .B(inst419_data_out), .gr(inst422_gr));  // open: ls, eq
  REGX #(.size(10), .default_value(733)) inst307 (
    .clk(CLK), .data_out(inst307_data_out));  // open: ld, cl, inc, dec, data_in
  CMPX #(.size(10)) inst286 (.A(X), .B(inst307_data_out), .gr(inst286_gr));  // open: ls, eq
  REGX #(.size(10), .default_value(360)) inst293 (
    .clk(CLK), .data_out(inst293_data_out));  // open: ld, cl, inc, dec, data_in
  CMPX #(.size(10)) inst292 (.A(Y), .B(inst293_data_out), .gr(inst292_gr));  // open: ls, eq
  REGX #(.size(10), .default_value(760)) inst399 (
    .clk(CLK), .data_out(inst399_data_out));  // open: ld, cl, inc, dec, data_in
  CMPX #(.size(10)) inst389 (.A(X), .B(inst399_data_out), .ls(inst389_ls));  // open: eq, gr
  REGX #(.size(10), .default_value(375)) inst401 (
    .clk(CLK), .data_out(inst401_data_out));  // open: ld, cl, inc, dec, data_in
  CMPX #(.size(10)) inst396 (.A(Y), .B(inst401_data_out), .ls(inst396_ls));  // open: eq, gr
  REGX #(.size(10), .default_value(765)) inst418 (
    .clk(CLK), .data_out(inst418_data_out));  // open: ld, cl, inc, dec, data_in
  CMPX #(.size(10)) inst413 (.A(X), .B(inst418_data_out), .ls(inst413_ls));  // open: eq, gr
  REGX #(.size(10), .default_value(375)) inst420 (
    .clk(CLK), .data_out(inst420_data_out));  // open: ld, cl, inc, dec, data_in
  CMPX #(.size(10)) inst415 (.A(Y), .B(inst420_data_out), .ls(inst415_ls));  // open: eq, gr
  REGX #(.size(10), .default_value(745)) inst306 (
    .clk(CLK), .data_out(inst306_data_out));  // open: ld, cl, inc, dec, data_in
  CMPX #(.size(10)) inst287 (.A(X), .B(inst306_data_out), .ls(inst287_ls));  // open: eq, gr
  REGX #(.size(10), .default_value(365)) inst294 (
    .clk(CLK), .data_out(inst294_data_out));  // open: ld, cl, inc, dec, data_in
  CMPX #(.size(10)) inst289 (.A(Y), .B(inst294_data_out), .ls(inst289_ls));  // open: eq, gr
  and inst390 (inst390_out, inst389_ls, inst388_gr);
  and inst397 (inst397_out, inst396_ls, inst403_gr);
  and inst414 (inst414_out, inst413_ls, inst412_gr);
  and inst416 (inst416_out, inst415_ls, inst422_gr);
  and inst288 (inst288_out, inst287_ls, inst286_gr);
  and inst290 (inst290_out, inst289_ls, inst292_gr);
  and inst398 (s1v, inst390_out, inst397_out);
  and inst291 (levarukapokret, inst288_out, inst290_out);
  and inst417 (s2v, inst414_out, inst416_out);
  REGX #(.size(10), .default_value(765)) inst467 (
    .clk(CLK), .data_out(inst467_data_out));  // open: ld, cl, inc, dec, data_in
  CMPX #(.size(10)) inst431 (.A(X), .B(inst467_data_out), .gr(inst431_gr));  // open: ls, eq
  REGX #(.size(10), .default_value(365)) inst437 (
    .clk(CLK), .data_out(inst437_data_out));  // open: ld, cl, inc, dec, data_in
  CMPX #(.size(10)) inst439 (.A(Y), .B(inst437_data_out), .gr(inst439_gr));  // open: ls, eq
  REGX #(.size(10), .default_value(770)) inst457 (
    .clk(CLK), .data_out(inst457_data_out));  // open: ld, cl, inc, dec, data_in
  REGX #(.size(10), .default_value(365)) inst455 (
    .clk(CLK), .data_out(inst455_data_out));  // open: ld, cl, inc, dec, data_in
  CMPX #(.size(10)) inst458 (.A(Y), .B(inst455_data_out), .gr(inst458_gr));  // open: ls, eq
  CMPX #(.size(10)) inst448 (.A(X), .B(inst457_data_out), .gr(inst448_gr));  // open: ls, eq
  REGX #(.size(10), .default_value(770)) inst468 (
    .clk(CLK), .data_out(inst468_data_out));  // open: ld, cl, inc, dec, data_in
  CMPX #(.size(10)) inst432 (.A(X), .B(inst468_data_out), .ls(inst432_ls));  // open: eq, gr
  REGX #(.size(10), .default_value(375)) inst438 (
    .clk(CLK), .data_out(inst438_data_out));  // open: ld, cl, inc, dec, data_in
  CMPX #(.size(10)) inst434 (.A(Y), .B(inst438_data_out), .ls(inst434_ls));  // open: eq, gr
  REGX #(.size(10), .default_value(775)) inst454 (
    .clk(CLK), .data_out(inst454_data_out));  // open: ld, cl, inc, dec, data_in
  REGX #(.size(10), .default_value(375)) inst456 (
    .clk(CLK), .data_out(inst456_data_out));  // open: ld, cl, inc, dec, data_in
  CMPX #(.size(10)) inst451 (.A(Y), .B(inst456_data_out), .ls(inst451_ls));  // open: eq, gr
  CMPX #(.size(10)) inst449 (.A(X), .B(inst454_data_out), .ls(inst449_ls));  // open: eq, gr
  and inst433 (inst433_out, inst432_ls, inst431_gr);
  and inst435 (inst435_out, inst434_ls, inst439_gr);
  and inst450 (inst450_out, inst449_ls, inst448_gr);
  and inst452 (inst452_out, inst451_ls, inst458_gr);
  and inst436 (s3v, inst433_out, inst435_out);
  and inst453 (s4v, inst450_out, inst452_out);
  REGX #(.size(10), .default_value(775)) inst486 (
    .clk(CLK), .data_out(inst486_data_out));  // open: ld, cl, inc, dec, data_in
  CMPX #(.size(10)) inst469 (.A(X), .B(inst486_data_out), .gr(inst469_gr));  // open: ls, eq
  REGX #(.size(10), .default_value(365)) inst475 (
    .clk(CLK), .data_out(inst475_data_out));  // open: ld, cl, inc, dec, data_in
  CMPX #(.size(10)) inst477 (.A(Y), .B(inst475_data_out), .gr(inst477_gr));  // open: ls, eq
  or inst490 (svetlo, s2v, s4v);
  or inst492 (svetloo, s1v, s3v, s5v);
  REGX #(.size(10), .default_value(780)) inst487 (
    .clk(CLK), .data_out(inst487_data_out));  // open: ld, cl, inc, dec, data_in
  CMPX #(.size(10)) inst470 (.A(X), .B(inst487_data_out), .ls(inst470_ls));  // open: eq, gr
  REGX #(.size(10), .default_value(375)) inst476 (
    .clk(CLK), .data_out(inst476_data_out));  // open: ld, cl, inc, dec, data_in
  CMPX #(.size(10)) inst472 (.A(Y), .B(inst476_data_out), .ls(inst472_ls));  // open: eq, gr
  and inst471 (inst471_out, inst470_ls, inst469_gr);
  and inst473 (inst473_out, inst472_ls, inst477_gr);
  and inst474 (s5v, inst471_out, inst473_out);

  // Other names for the same wires on the sheet: metak = takme; prikazi = valid

  // Notes on the sheet:
  //   RISING_EDGE
  //   RISING_EDGE
  //   RISING_EDGE
endmodule
